# EasyEDA Pro project Dual_handheld_laser_sword_2.0.eprj

# Schematic Laserreczny2.0
Board Name: Laserreczny2.0; Create Date: 2024-09-04; Page Name: Laserreczny2.0; Project Name: Laserreczny2.0-2023-01-02_124553; Schematic Name: Laserreczny2.0; Update Date: 2025-07-18; Company: EasyEDA.com; Page Size: A4; Version: V1.0
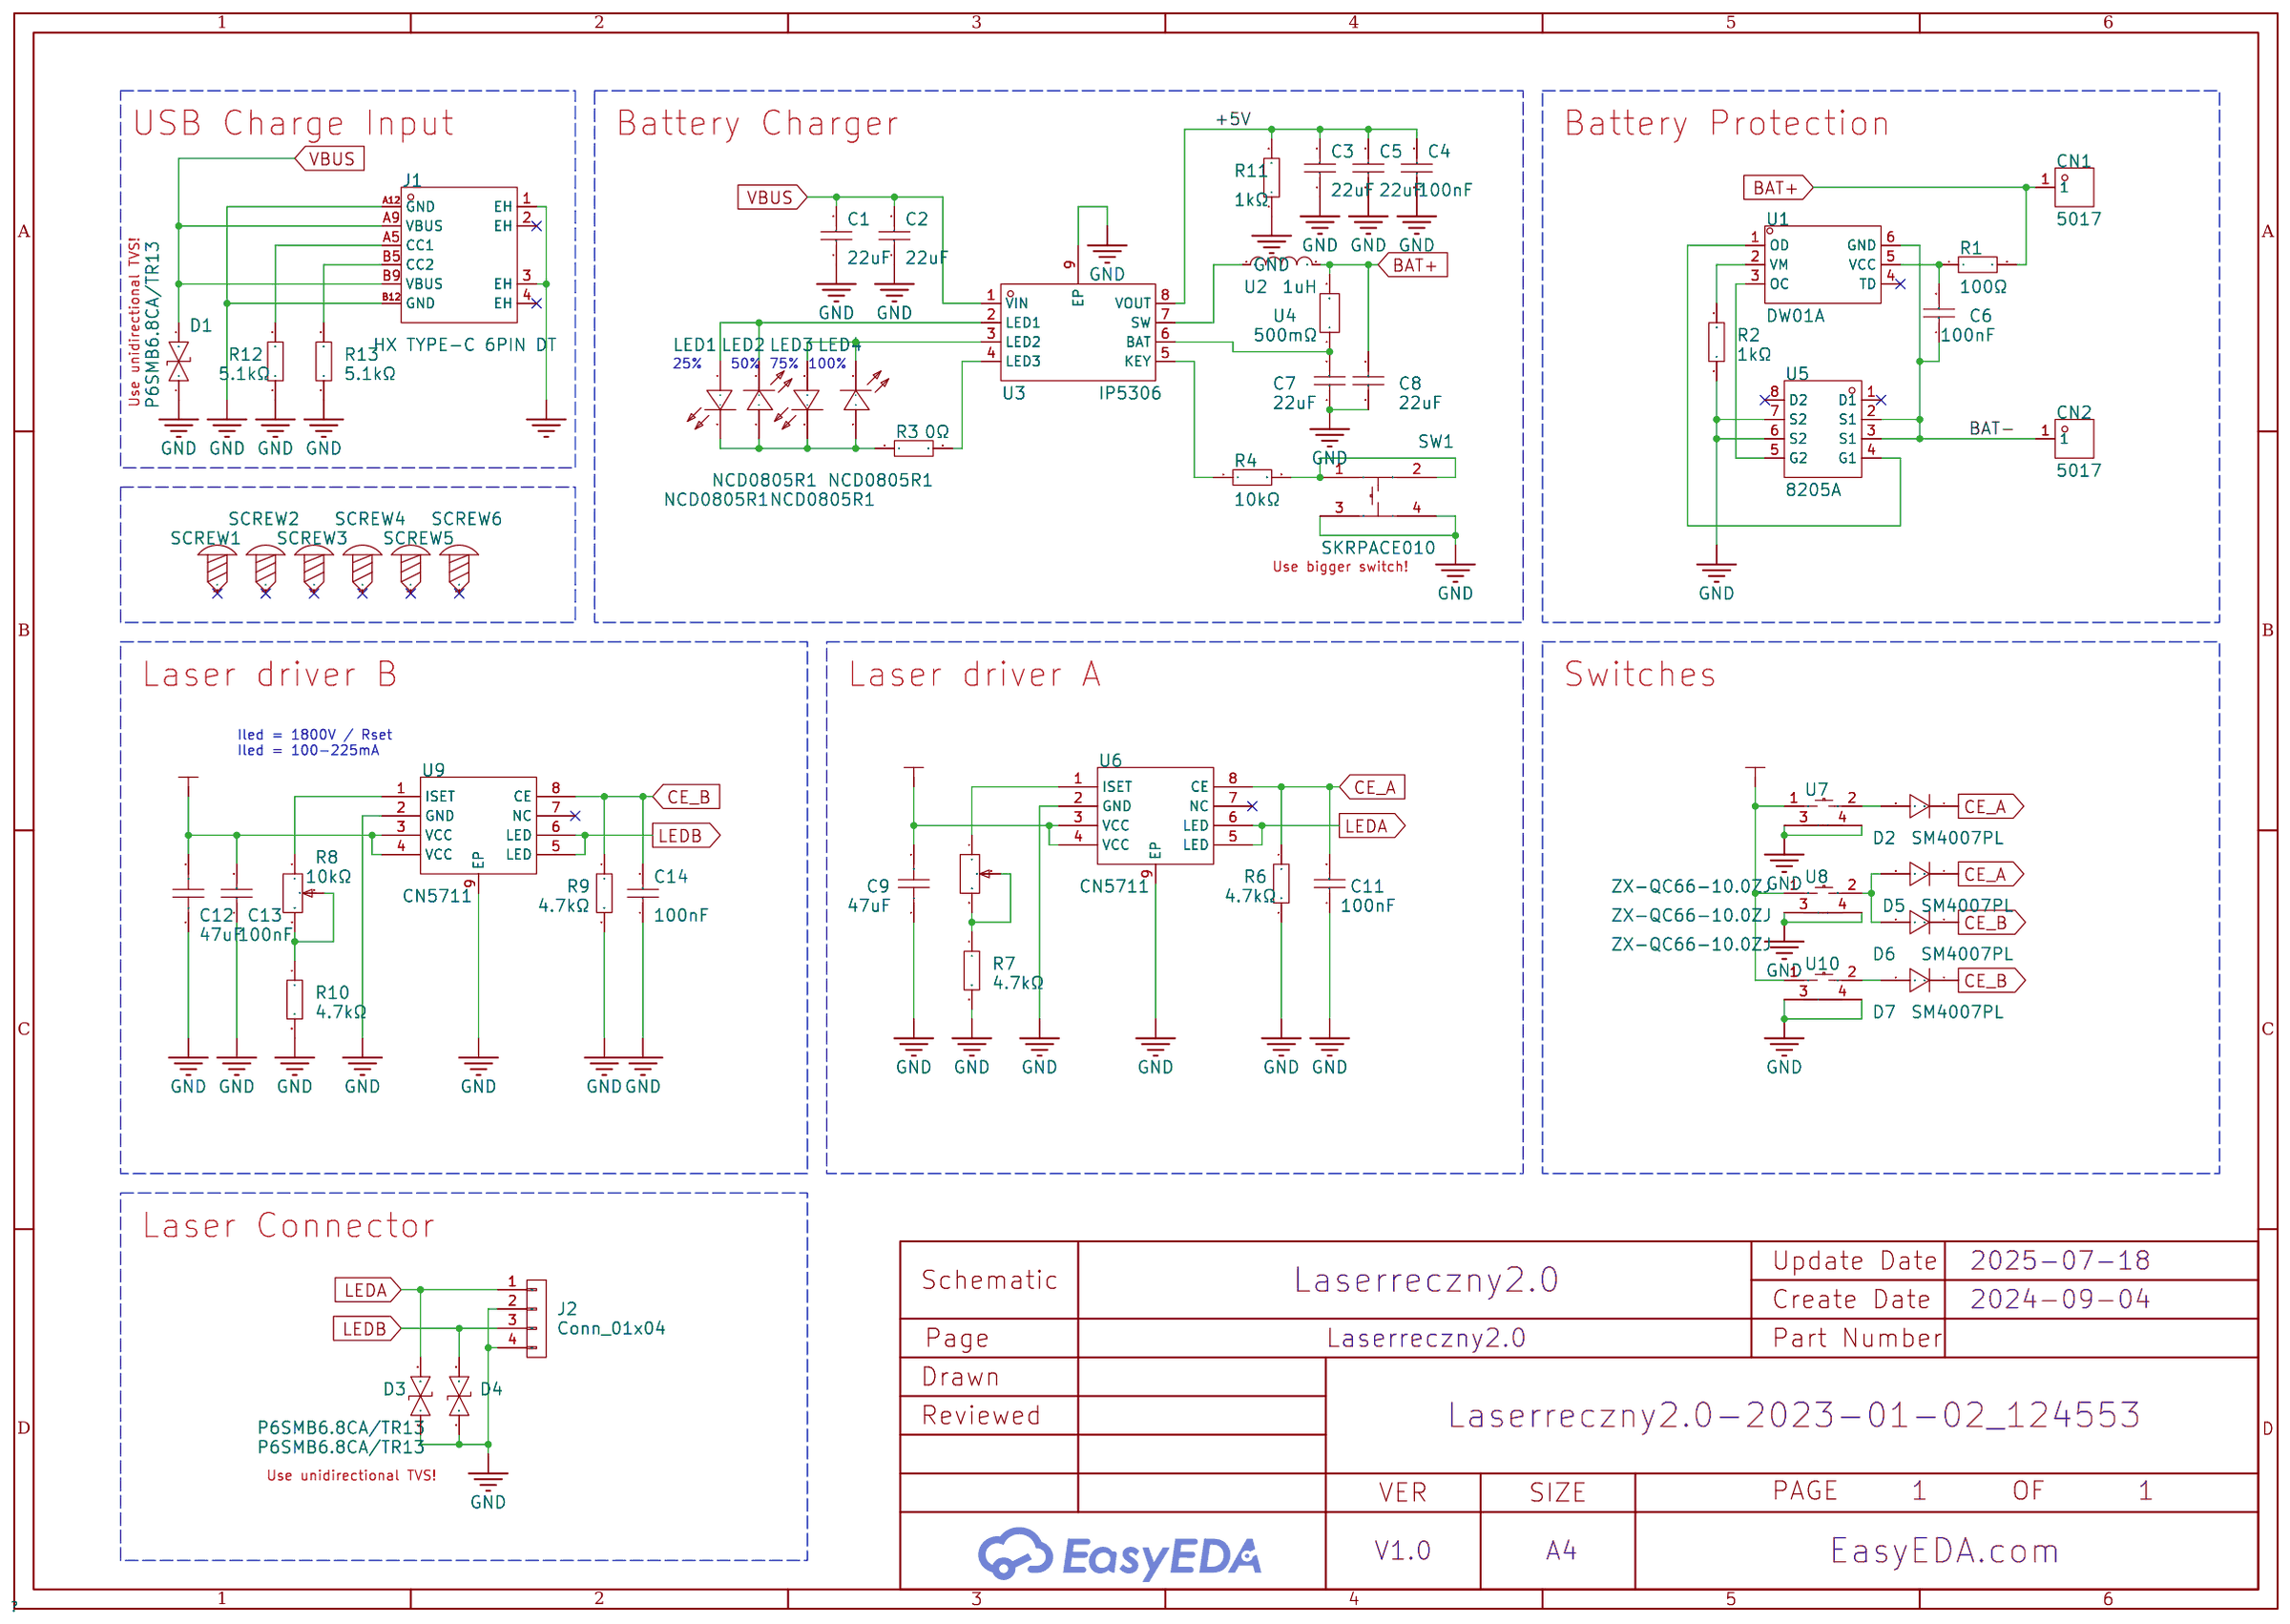
[diagram p0: schematic sheet]

## Parts
C1  22uF  [C1206]
C2  22uF  [C1206]
C3  22uF  [C1206]
C4  22uF  [C1206]
C5  100nF  [C1206]
C6  100nF  [C1206]
C7  22uF  [C1206]
C8  22uF  [C1206]
C9  47uF  [C1206]
C11  100nF  [C1206]
C12  47uF  [C1206]
C13  100nF  [C1206]
C14  100nF  [C1206]
CN1  5017  [CONN-SMD_5017]  (no BOM)
CN2  5017  [CONN-SMD_5017]  (no BOM)
D1  P6SMB6.8CA/TR13  [SMB_L4.6-W3.6-LS5.3-BI]
D2  SM4007PL  [SOD-123F_L2.8-W1.8-LS3.7-RD]
D3  P6SMB6.8CA/TR13  [SMB_L4.6-W3.6-LS5.3-BI]
D4  P6SMB6.8CA/TR13  [SMB_L4.6-W3.6-LS5.3-BI]
D5  SM4007PL  [SOD-123F_L2.8-W1.8-LS3.7-RD]
D6  SM4007PL  [SOD-123F_L2.8-W1.8-LS3.7-RD]
D7  SM4007PL  [SOD-123F_L2.8-W1.8-LS3.7-RD]
J1  HX TYPE-C 6PIN DT  [TYPE-C-SMD_TYPE-C-31-M-16]
J2  Conn_01x04  [Nowy folder:UCHWYTLASERA3]  (no BOM)
LED1  NCD0805R1  [LED0805-R-RD]
LED2  NCD0805R1  [LED0805-R-RD]
LED3  NCD0805R1  [LED0805-R-RD]
LED4  NCD0805R1  [LED0805-R-RD]
R1  100Ω  [R0805]
R2  1kΩ  [R0805]
R3  0Ω  [R1206]
R4  10kΩ  [R1206]
R5  10kΩ  [RES-ADJ-TH_3296W]
R6  4.7kΩ  [R1206]
R7  4.7kΩ  [R1206]
R8  10kΩ  [RES-ADJ-TH_3296W]
R9  4.7kΩ  [R1206]
R10  4.7kΩ  [R1206]
R11  1kΩ  [R0805]
R12  5.1kΩ  [R0805]
R13  5.1kΩ  [R0805]
SCREW1  -  [Screw-Hole-M2]
SCREW2  -  [Screw-Hole-M2]
SCREW3  -  [Screw-Hole-M2]
SCREW4  -  [Screw-Hole-M2]
SCREW5  -  [Screw-Hole-M3]
SCREW6  -  [Screw-Hole-M3]
SW1  SKRPACE010  [KEY-SMD_4P-L4.2-W3.2-P2.20-LS4.6]
U1  DW01A  [SOT-23-6_L2.9-W1.6-P0.95-LS2.8-BL]
U2  1uH  [IND-SMD_L11.5-W10.0]
U3  IP5306  [ESOP-8_L4.9-W3.9-P1.27-LS6.0-BL-EP]
U4  500mΩ  [R0603]
U5  8205A  [TSSOP-8_L4.4-W3.0-P0.65-LS6.4-BL]
U6  CN5711  [SOIC-8_L5.0-W4.0-P1.27-LS6.0-BL-EP2.0]
U7  ZX-QC66-10.0ZJ  [SW-TH_4P-L7.5-W5.5-P4.50]
U8  ZX-QC66-10.0ZJ  [SW-TH_4P-L7.5-W5.5-P4.50]
U9  CN5711  [SOIC-8_L5.0-W4.0-P1.27-LS6.0-BL-EP2.0]
U10  ZX-QC66-10.0ZJ  [SW-TH_4P-L7.5-W5.5-P4.50]

## Library data of the parts
C1-C4 C7 C8 = CL31A226KAHNNNE: LCSC Part Name: 22uF ±10% 25V; Supplier Part: C12891; Manufacturer: SAMSUNG(三星); Supplier Footprint: 1206; JLCPCB Part Class: Basic Part; Datasheet: https://atta.szlcsc.com/upload/public/pdf/source/20160218/1457707763339.pdf; Supplier: LCSC; Tolerance: ±10%
C5 C6 C11 C13 C14 = CL31B104KBCNNNC: LCSC Part Name: 100nF ±10% 50V; Supplier Part: C24497; Manufacturer: SAMSUNG(三星); Supplier Footprint: 1206; JLCPCB Part Class: Basic Part; Datasheet: https://atta.szlcsc.com/upload/public/pdf/source/20160218/1457707763339.pdf; Supplier: LCSC; Tolerance: ±10%
C9 C12 = CL31A476MPHNNNE: LCSC Part Name: 47uF ±20% 10V; Supplier Part: C96123; Manufacturer: SAMSUNG(三星); Supplier Footprint: 1206; JLCPCB Part Class: Basic Part; Datasheet: https://atta.szlcsc.com/upload/public/pdf/source/20160218/1457707763339.pdf; Supplier: LCSC; Tolerance: ±20%
CN1 CN2 = 5017: Supplier Part: C9900015874; Supplier Footprint: Testpoint_SMD; JLCPCB Part Class: Extended Part; Supplier: LCSC
D1 D3 D4 = P6SMB6.8CA/TR13: Supplier Part: C78395; Manufacturer: Brightking(君耀电子); Supplier Footprint: SMB(DO-214AA); JLCPCB Part Class: Basic Part; Datasheet: https://atta.szlcsc.com/upload/public/pdf/source/20160709/1468031879762.pdf; Supplier: LCSC; Reverse Stand-Off Voltage (Vrwm): 5.8V; Maximum Clamping Voltage: 10.5V; Peak Pulse Current (Ipp)@10/1000us: 58.1A; Peak Pulse Power Dissipation (Ppp)@10/1000us: 600W; Breakdown Voltage: 6.45V; Type: TVS
D2 D5-D7 = SM4007PL_C64898: LCSC Part Name: 电压:1kV 电流:1A; Supplier Part: C64898; Manufacturer: MDD(辰达半导体); Supplier Footprint: SOD-123FL; JLCPCB Part Class: Basic Part; Datasheet: https://atta.szlcsc.com/upload/public/pdf/source/20230823/16A8FDE162764C9B685A3717F2DA3690.pdf; Supplier: LCSC; Forward Voltage (Vf@If): 1.1V@1A; Reverse Leakage Current: 10uA@1kV
J1 = HX TYPE-C 6PIN DT: Connector Type:Type-C Gender:Female Mounting Style:Horizontal attachment Number of Contacts:6P Number of Ports:1 Current Rating - Power (Max):3A Operating Temperature Range:-25℃~+85℃ Operating Temperature Range:-25℃~+85℃; LCSC Part Name: Type-C 母 卧贴; Supplier Part: C18357554; Manufacturer: hanxia(韩下); Supplier Footprint: SMD; JLCPCB Part Class: Extended Part; Datasheet: https://atta.szlcsc.com/upload/public/pdf/source/20240715/9DA76AB0C307AE71049E18D789077764.pdf; Supplier: LCSC; Connector Type: Type-C; Gender: Female; Mounting Style: Horizontal attachment; Number of Contacts: 6P; Number of Ports: 1; Current Rating - Power (Max): 3A; Operating Temperature Range: -25℃~+85℃
J2 = New_Library2_Conn_01x04
LED1-LED4 = NCD0805R1_C84256: Supplier Part: C84256; Manufacturer: 国星光电; Supplier Footprint: 0805; JLCPCB Part Class: Basic Part; Datasheet: https://atta.szlcsc.com/upload/public/pdf/source/20200820/C84256_F0A75A43B3EAD75808600A0514C76B99.pdf; Supplier: LCSC; Emitted Color: Red; Forward Voltage (VF): 1.6V~2.6V; Power Dissipation: 65mW; Forward Current: 20mA; Dominant Wavelength: 615nm~630nm; Diode Configuration: 独立二极管; Lens Color: 无色透明透镜; Luminous Intensity: 67mcd~195mcd; Viewing Angle: 130°; Operating Temperature: -30℃~+85℃
R1 = 0805W8F1000T5E_C17408: LCSC Part Name: 100Ω ±1% 125mW 厚膜电阻; Supplier Part: C17408; Manufacturer: UNI-ROYAL(厚声); Manufacturer Part: 0805W8F1000T5E; Supplier Footprint: 0805; JLCPCB Part Class: Basic Part; Datasheet: https://atta.szlcsc.com/upload/public/pdf/source/20200306/C422600_1E6D84923E4A46A82E41ADD87F860B5C.pdf; Supplier: LCSC; Type: Thick Film Resistors; Tolerance: ±1%; Temperature Coefficient: ±100ppm/℃; Operating Temperature Range: -55℃~+155℃
R2 R11 = 0805W8F1001T5E: LCSC Part Name: 1kΩ ±1% 125mW 厚膜电阻; Supplier Part: C17513; Manufacturer: UNI-ROYAL(厚声); Supplier Footprint: 0805; JLCPCB Part Class: Basic Part; Datasheet: https://atta.szlcsc.com/upload/public/pdf/source/20200306/C422600_1E6D84923E4A46A82E41ADD87F860B5C.pdf; Supplier: LCSC; Type: Thick Film Resistors; Tolerance: ±1%; Temperature Coefficient: ±100ppm/℃; Operating Temperature Range: -55℃~+155℃
R3 = 1206W4F0000T5E: LCSC Part Name: 0Ω ±1% 250mW 厚膜电阻; Supplier Part: C17888; Manufacturer: UNI-ROYAL(厚声); Supplier Footprint: 1206; JLCPCB Part Class: Basic Part; Datasheet: https://atta.szlcsc.com/upload/public/pdf/source/20200306/C422600_1E6D84923E4A46A82E41ADD87F860B5C.pdf; Supplier: LCSC; Type: Thick Film Resistors; Tolerance: ±1%; Temperature Coefficient: ±800ppm/℃; Operating Temperature Range: -55℃~+155℃
R4 = 1206W4F1002T5E: LCSC Part Name: 10kΩ ±1% 250mW 厚膜电阻; Supplier Part: C17902; Manufacturer: UNI-ROYAL(厚声); Supplier Footprint: 1206; JLCPCB Part Class: Basic Part; Datasheet: https://atta.szlcsc.com/upload/public/pdf/source/20200306/C422600_1E6D84923E4A46A82E41ADD87F860B5C.pdf; Supplier: LCSC; Type: Thick Film Resistors; Tolerance: ±1%; Temperature Coefficient: ±100ppm/℃; Operating Temperature Range: -55℃~+155℃
R5 R8 = 3296W-1-103LF: LCSC Part Name: 10kΩ ±10%; Supplier Part: C34846; Manufacturer: BOURNS; Supplier Footprint: SIP-3P,9.5x4.8mm; JLCPCB Part Class: Extended Part; Datasheet: https://atta.szlcsc.com/upload/public/pdf/source/20151026/1457707506403.pdf; Supplier: LCSC; Tolerance: ±10%; Temperature Coefficient: ±100ppm/℃
R6 R7 R9 R10 = 1206W4F4701T5E: LCSC Part Name: 4.7kΩ ±1% 250mW 厚膜电阻; Supplier Part: C17936; Manufacturer: UNI-ROYAL(厚声); Supplier Footprint: 1206; JLCPCB Part Class: Basic Part; Datasheet: https://atta.szlcsc.com/upload/public/pdf/source/20200306/C422600_1E6D84923E4A46A82E41ADD87F860B5C.pdf; Supplier: LCSC; Type: Thick Film Resistors; Tolerance: ±1%; Temperature Coefficient: ±100ppm/℃; Operating Temperature Range: -55℃~+155℃
R12 R13 = RMC08055.1K5%N: LCSC Part Name: 5.1kΩ ±5% 125mW; Supplier Part: C269736; Manufacturer: Tyohm(幸亚电阻); Supplier Footprint: 0805; JLCPCB Part Class: Extended Part; Datasheet: https://atta.szlcsc.com/upload/public/pdf/source/20190115/C325956_D27151D492FFB3C9AB4A6F14FE01F30A.pdf; Supplier: LCSC; Tolerance: ±5%
SCREW1-SCREW4 = Screw-Hole-M2: Supplier Footprint: 插件
SCREW5 SCREW6 = Screw-Hole-M3: Supplier Footprint: 插件
SW1 = SKRPACE010: LCSC Part Name: 4.2*3.2*2.5mm 立贴 轻触开关; Supplier Part: C139797; Manufacturer: ALPSALPINE(阿尔卑斯阿尔派); Supplier Footprint: SMD; JLCPCB Part Class: Extended Part; Datasheet: https://atta.szlcsc.com/upload/public/pdf/source/20171113/C139797_15105612676371115729.pdf; Supplier: LCSC; Circuit: SPST; Actuator Style: Oval button; Mounting Style: Brick nogging; Switch Length: 4.2mm; Switch Width: 3.2mm; Switch Height: 2.5mm; Contact Current: 50mA; Voltage Rating (DC): 16V
U1 = DW01A_C351410: Supplier Part: C351410; Manufacturer: PUOLOP(迪浦); Supplier Footprint: SOT-23-6L; JLCPCB Part Class: Extended Part; Datasheet: https://atta.szlcsc.com/upload/public/pdf/source/20190109/C351410_3E9B9491D1909DF24C48D1B9CD871392.pdf; Supplier: LCSC
U2 = FXL1050-1R0-M: LCSC Part Name: 1uH ±20% 30A; Supplier Part: C5359257; Manufacturer: cjiang(长江微电); Supplier Footprint: SMD,10x11.5mm; JLCPCB Part Class: Extended Part; Datasheet: https://atta.szlcsc.com/upload/public/pdf/source/20240426/3189EA8206330E2108542F9E34E540E7.pdf; Supplier: LCSC; Tolerance: ±20%; Saturation Current (Isat): 30A; Type: Integrated molded inductor
U3 = IP5306: Supplier Part: C181692; Manufacturer: INJOINIC(英集芯); Supplier Footprint: ESOP-8; JLCPCB Part Class: Extended Part; Datasheet: https://atta.szlcsc.com/upload/public/pdf/source/20190627/C384572_9925B3DDC4041BC6108E5AB46A2A0AB1.pdf; Supplier: LCSC
U4 = FRL0603JR500TS: LCSC Part Name: 500mΩ ±5% 100mW 厚膜电阻; Supplier Part: C2930046; Manufacturer: FOJAN(富捷); Supplier Footprint: 0603; JLCPCB Part Class: Extended Part; Datasheet: https://atta.szlcsc.com/upload/public/pdf/source/20211221/925EC7D7225764EE0046F22065062C87.pdf; Supplier: LCSC; Type: Thick Film Resistors; Tolerance: ±5%; Temperature Coefficient: ±300ppm/℃; Operating Temperature Range: -55℃~+155℃
U5 = 8205A_C7499846: LCSC Part Name: 2个N沟道 耐压:20V 电流:6A; Supplier Part: C7499846; Manufacturer: HL(富海微); Supplier Footprint: TSSOP-8; JLCPCB Part Class: Extended Part; Datasheet: https://atta.szlcsc.com/upload/public/pdf/source/20240724/664F23CBF70CFE9FA07822926B1155CC.pdf; Supplier: LCSC; Type: 2 N-Channel; Drain Source Voltage (Vdss): 20V; Drain Source On Resistance (RDS(on)@Vgs,Id): 19mΩ; Gate Threshold Voltage (Vgs(th)@Id): 1.2V
U6 U9 = CN5711: Supplier Part: C35634; Manufacturer: CONSONANCE(上海如韵); Supplier Footprint: SOIC-8-EP; JLCPCB Part Class: Extended Part; Datasheet: https://atta.szlcsc.com/upload/public/pdf/source/20151111/1457707576158.pdf; Supplier: LCSC; Input Voltage: 2.8V~6V
U7 U8 U10 = ZX-QC66-10.0ZJ: LCSC Part Name: 6*6*10.0支架; Supplier Part: C7470149; Manufacturer: Megastar(兆星); Supplier Footprint: DIP; JLCPCB Part Class: Extended Part; Datasheet: https://atta.szlcsc.com/upload/public/pdf/source/20230724/750A58BC0FA2FA475D6161C007562EDE.pdf; Supplier: LCSC; Circuit: SPST; Actuator Style: Round Button; Operating Force: 260gf; Mounting Style: Straight; Switch Length: 6mm; Switch Width: 6mm; Switch Height: 10mm; Strike Gundam: 带支架; Contact Current: 50mA; Voltage Rating (AC): 250V; Voltage Rating (DC): 12V; Insulation Resistance: 100MΩ; Actuator/Cap Color: Black; Pin Style: PCPin; Mechanical Life: 10万次; Operating Temperature: -30℃~+80℃

## Nets
+5V: C3.2 C4.2 C5.2 R11.2 U3.8(VOUT)
GND: C1.1 C2.1 C3.1 C4.1 C5.1 C7.1 C8.1 C9.1 C11.1 C12.1 C13.1 C14.1 D1.1 D3.1 D4.1 J1.A12(GND) J1.B12(GND) J2.2(Pin) J2.4(Pin) R2.1 R6.2 R7.2 R9.2 R10.2 R11.1 R12.1 R13.1 SW1.3 SW1.4 U3.9(EP) U5.6(S2) U5.7(S2) U6.2(GND) U6.9(EP) U7.3 U7.4 U8.3 U8.4 U9.2(GND) U9.9(EP) U10.3 U10.4
VBUS: C1.2 C2.2 D1.2 J1.A9(VBUS) J1.B9(VBUS) U3.1(VIN)
BAT+: C8.2 C9.2 C12.2 C13.2 CN1.1 R1.2 U2.2 U4.2 U6.3(VCC) U6.4(VCC) U7.1 U8.1 U9.3(VCC) U9.4(VCC) U10.1
BAT-: C6.1 CN2.1 J1.1(EH) J1.3(EH) U1.6(GND) U5.2(S1) U5.3(S1)
CE_A: C11.2 D2.1(C) D5.1(C) R6.1 U6.8(CE)
CE_B: C14.2 D6.1(C) D7.1(C) R9.1 U9.8(CE)
LEDA: D3.2 J2.1(Pin) U6.5(LED) U6.6(LED)
LEDB: D4.2 J2.3(Pin) U9.5(LED) U9.6(LED)
$1N3617: R5.2 R5.3 R7.1
$1N3639: R8.2 R8.3 R10.1
$1N4317: D2.2(A) U7.2
$1N4424: D7.2(A) U10.2
$1N4465: D5.2(A) D6.2(A) U8.2
$1N5157: R3.2 U3.4(LED3)
$1N5164: LED1.2(-) LED2.1(+) LED3.2(-) LED4.1(+) R3.1
$1N5205: LED3.1(+) LED4.2(-) U3.3(LED2)
$1N5221: LED1.1(+) LED2.2(-) U3.2(LED1)
$1N5255: R4.1 U3.5(KEY)
$1N6778: U2.1 U3.7(SW)
$1N6905: R4.2 SW1.1 SW1.2
$1N7101: C7.2 U3.6(BAT) U4.1
$1N13509: R2.2 U1.2(VM)
$1N13530: U1.3(OC) U5.5(G2)
$1N13537: U1.1(OD) U5.4(G1)
$1N13688: C6.2 R1.1 U1.5(VCC)
$1N13830: R8.1 U9.1(ISET)
$1N13861: R5.1 U6.1(ISET)
$1N21573: J1.A5(CC1) R12.2
$1N21578: J1.B5(CC2) R13.2

Not connected (* = marked no-connect by the designer): J1 2(EH)* 4(EH)*; SCREW1 1*; SCREW2 1*; SCREW3 1*; SCREW4 1*; SCREW5 1*; SCREW6 1*; U1 4(TD)*; U5 1(D1)* 8(D2)*; U6 7(NC)*; U9 7(NC)*

## Notes on the sheet
- USB Charge Input
- Battery Charger
- Battery Protection
- 25%
- 50%
- 75%
- 100%
- Use unidirectional TVS!
- Use bigger switch!
- Laser driver B
- Laser driver A
- Switches
- Iled = 1800V / Rset
  Iled = 100-225mA
- Laser Connector
- Use unidirectional TVS!

# Board Laserreczny2.0
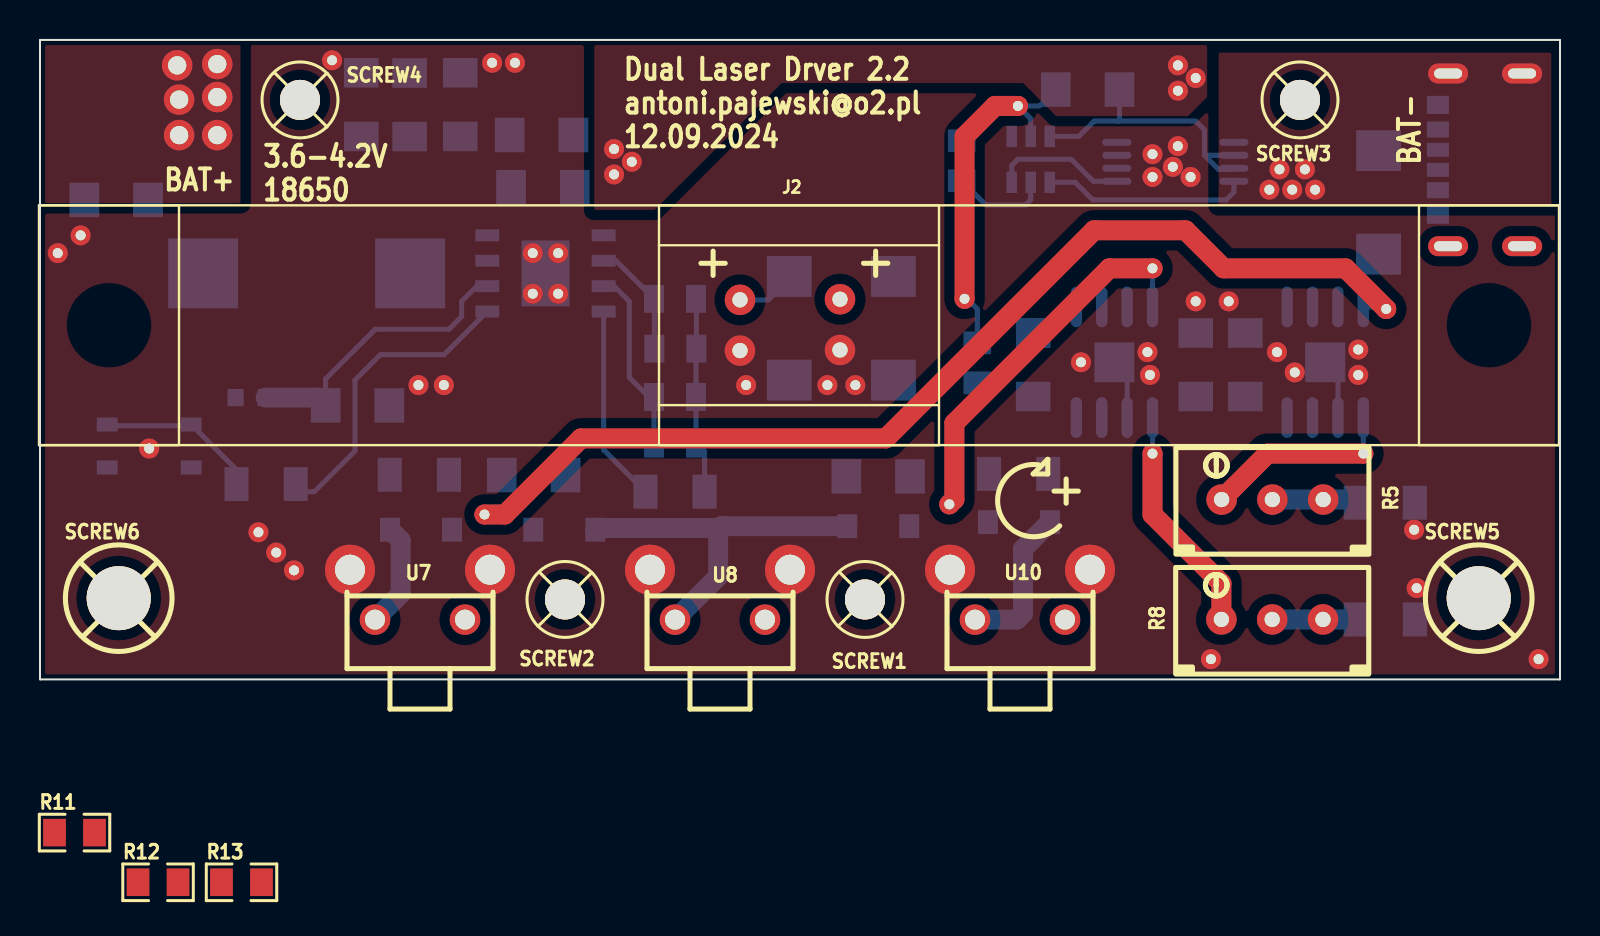
[diagram p1: board, top side]
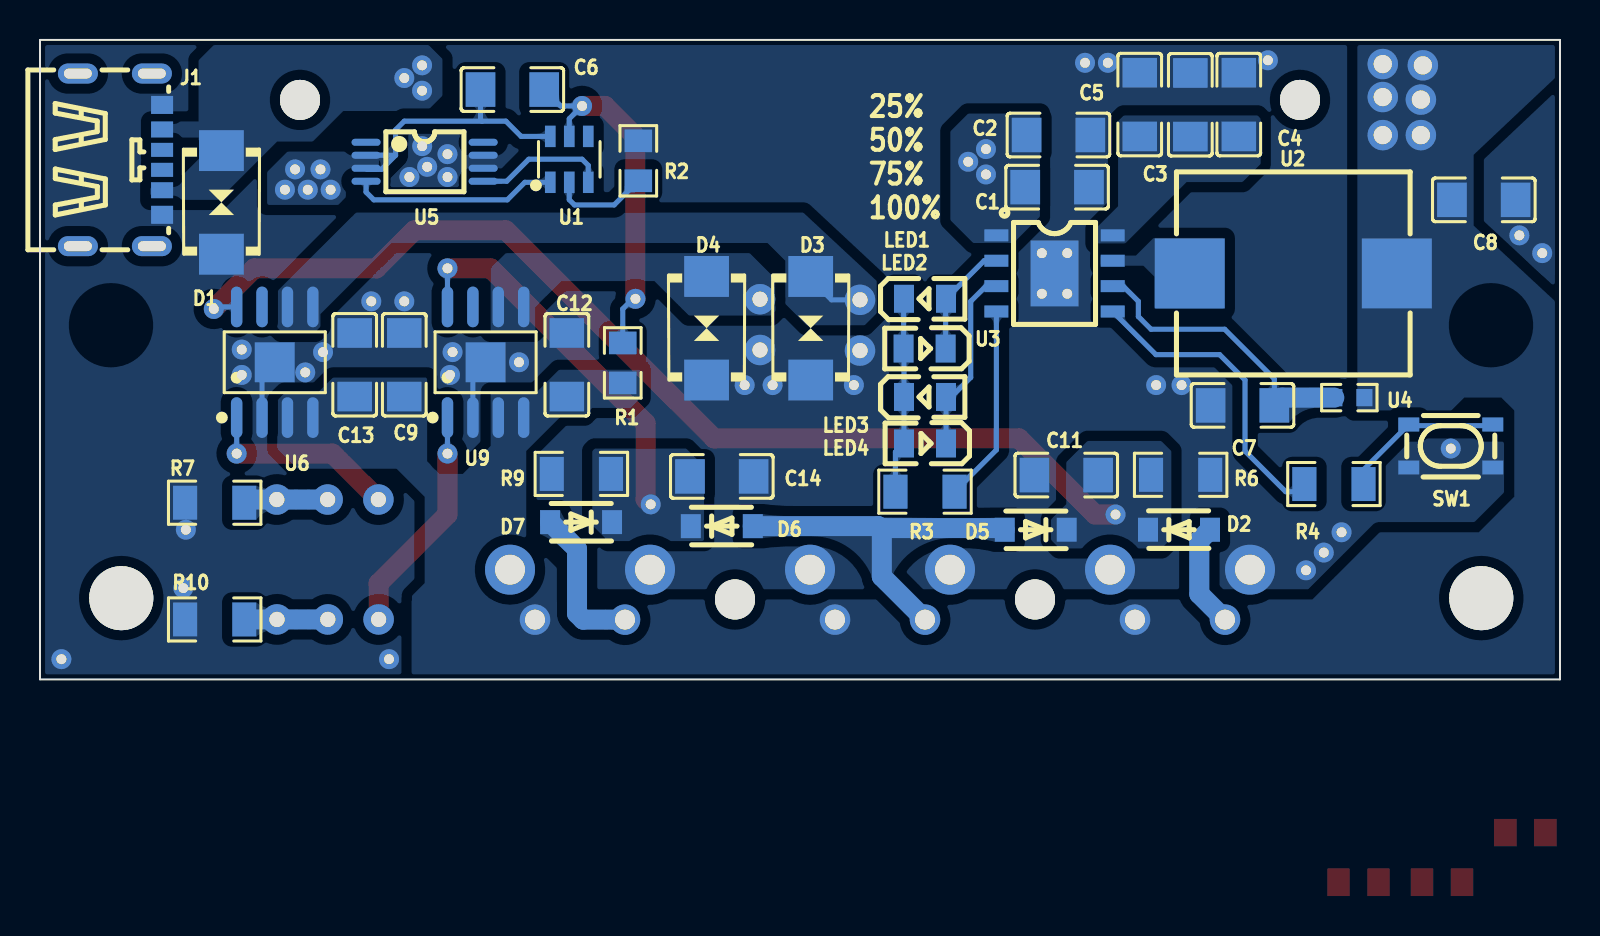
[diagram p2: board, bottom side, seen from below]

Outline 76 x 32 mm; copper layers: Top Layer, Bottom Layer. Coordinates in mm from the lower left corner of the outline.
Outline path: 0,32 76,32 76,0 0,0 0,32
Stack: Top Layer 0.035mm / dielectric 1 1.6mm FR4 er 4.5 / Bottom Layer 0.035mm

## Design rules (mm)
template: User Custom Config
spacing safeClearance (default): track to track 0.152, other pairs 0.152 to 0.3
track width trackWidth (default): min 0.127, default 0.254, max 2.54
differential pair differentialPair (default): width min 0.127, default 0.254, max 2.54; gap min 0.152, default 0.152
via viaSize (default): diameter min 0.5, default 0.61, max 10; hole min 0.3, default 0.305, max 5.999
net GND uses CopperRegion1
net LEDA uses CopperRegion1
net LEDB uses CopperRegion1
net BAT+ uses CopperRegion1
net VBUS uses CopperRegion1
net CE_A uses CopperRegion1
net CE_B uses CopperRegion1
net $1N6778 uses CopperRegion1
net $1N11856 uses CopperRegion1
net BAT- uses CopperRegion1

## Placement (name value [footprint] x y rotation side)
C1  22uF  [C1206]  25.15 24.63 0 bottom
C2  22uF  [C1206]  25.08 27.24 0 bottom
C3  22uF  [C1206]  18.48 28.76 270 bottom
C4  22uF  [C1206]  16.06 28.77 270 bottom
C5  100nF  [C1206]  21.01 28.77 270 bottom
C6  100nF  [C1206]  52.38 29.52 180 bottom
C7  22uF  [C1206]  15.88 13.71 180 bottom
C8  22uF  [C1206]  3.81 24 0 bottom
C9  47uF  [C1206]  57.78 15.74 270 bottom
C11  100nF  [C1206]  24.69 10.22 180 bottom
C12  47uF  [C1206]  49.66 15.74 270 bottom
C13  100nF  [C1206]  60.27 15.74 270 bottom
C14  100nF  [C1206]  41.91 10.16 0 bottom
D1  P6SMB6.8CA/TR13  [SMB_L4.6-W3.6-LS5.3-BI]  66.93 23.87 90 bottom
D2  SM4007PL  [SOD-123F_L2.8-W1.8-LS3.7-RD]  19.05 7.49 180 bottom
D3  P6SMB6.8CA/TR13  [SMB_L4.6-W3.6-LS5.3-BI]  37.47 17.57 90 bottom
D4  P6SMB6.8CA/TR13  [SMB_L4.6-W3.6-LS5.3-BI]  42.67 17.57 90 bottom
D5  SM4007PL  [SOD-123F_L2.8-W1.8-LS3.7-RD]  26.21 7.49 0 bottom
D6  SM4007PL  [SOD-123F_L2.8-W1.8-LS3.7-RD]  41.91 7.67 180 bottom
D7  SM4007PL  [SOD-123F_L2.8-W1.8-LS3.7-RD]  48.95 7.87 0 bottom
J1  HX TYPE-C 6PIN DT  [TYPE-C-SMD_TYPE-C-31-M-16]  72 26 270 bottom
J2  Conn_01x04  [Nowy folder:UCHWYTLASERA3]  37.5 17.67 0 top
LED1  NCD0805R1  [LED0805-R-RD]  31.75 19.05 180 bottom
LED2  NCD0805R1  [LED0805-R-RD]  31.77 16.56 0 bottom
LED3  NCD0805R1  [LED0805-R-RD]  31.75 14.13 180 bottom
LED4  NCD0805R1  [LED0805-R-RD]  31.75 11.81 0 bottom
NOREF  -  [Pad_e74]  68.71 7.49 0 top
NOREF#2  -  [Pad_e365]  22.22 8.25 0 top
NOREF#3  -  [Pad_e552]  28.7 26.54 90 top
NOREF#4  -  [Pad_e73]  68.83 4.57 0 top
NOREF#5  -  [Pad_e76]  59.44 18.92 0 top
NOREF#6  -  [Pad_e717]  8.86 27.24 0 top
NOREF#7  -  [Pad_e69]  10.92 7.36 0 top
NOREF#8  -  [Pad_e90]  22.61 30.86 0 top
NOREF#9  -  [Pad_e533]  56.9 29.46 90 top
NOREF#10  -  [Pad_e245]  65.91 16.51 0 top
NOREF#11  -  [Pad_e337]  48.9 28.7 0 top
NOREF#12  -  [Pad_e159]  55.63 20.57 0 top
NOREF#13  -  [Pad_e177]  25.91 21.33 0 top
NOREF#14  -  [Pad_e181]  24.64 19.3 0 top
NOREF#15  -  [Pad_e86]  35.31 14.73 0 top
NOREF#16  -  [Pad_e94]  58.55 1.01 0 top
NOREF#17  -  [Pad_e77]  40.77 14.73 0 top
NOREF#18  -  [Pad_e290]  56.89 26.69 0 top
NOREF#19  -  [Pad_e70]  5.46 11.55 0 top
NOREF#20  -  [Pad_e553]  28.7 25.27 90 top
NOREF#21  -  [Pad_e91]  23.75 30.86 0 top
NOREF#22  -  [Pad_e536]  55.63 26.28 0 top
NOREF#23  -  [Pad_e558]  62.61 24.51 90 top
NOREF#24  -  [Pad_e244]  65.91 15.24 0 top
NOREF#25  -  [Pad_e235]  55.37 16.38 0 top
NOREF#26  -  [Pad_e714]  6.96 29.02 0 top
NOREF#27  -  [Pad_e180]  24.64 21.33 0 top
NOREF#28  -  [Pad_e537]  56.64 25.65 0 top
NOREF#29  -  [Pad_e236]  52.05 15.87 0 top
NOREF#30  -  [Pad_e715]  6.96 27.24 0 top
NOREF#31  -  [Pad_e88]  20.19 14.73 0 top
NOREF#32  -  [Pad_e15]  66.17 11.3 0 top
NOREF#33  -  [Pad_e67]  12.7 5.46 0 top
NOREF#34  -  [Pad_e143]  6.86 30.73 0 top
NOREF#35  -  [Pad_e535]  55.63 25.14 0 top
NOREF#36  -  [Pad_e89]  14.61 30.98 0 top
NOREF#37  -  [Pad_e727]  0.89 21.33 0 top
NOREF#38  -  [Pad_e238]  62.74 15.36 0 top
NOREF#39  -  [Pad_e530]  56.9 30.73 90 top
NOREF#40  -  [Pad_e366]  45.47 8.76 0 top
NOREF#41  -  [Pad_e719]  8.86 30.79 0 top
NOREF#42  -  [Pad_e557]  61.47 24.51 90 top
NOREF#43  -  [Pad_e562]  63.25 25.52 90 top
NOREF#44  -  [Pad_e16]  55.63 11.3 0 top
NOREF#45  -  [Pad_e534]  57.78 30.09 90 top
NOREF#46  -  [Pad_e559]  63.75 24.51 90 top
NOREF#47  -  [Pad_e560]  61.98 25.52 90 top
NOREF#48  -  [Pad_e160]  67.31 18.54 0 top
NOREF#49  -  [Pad_e289]  57.53 25.14 0 top
NOREF#50  -  [Pad_e726]  2.03 22.22 0 top
NOREF#51  -  [Pad_e243]  61.85 16.38 0 top
NOREF#52  -  [Pad_e68]  11.81 6.35 0 top
NOREF#53  -  [Pad_e303]  46.23 19.05 0 top
NOREF#54  -  [Pad_e179]  25.91 19.3 0 top
NOREF#55  -  [Pad_e93]  74.93 1.01 0 top
NOREF#56  -  [Pad_e554]  29.59 25.9 90 top
NOREF#57  -  [Pad_e75]  57.78 18.92 0 top
NOREF#58  -  [Pad_e85]  39.37 14.73 0 top
NOREF#59  -  [Pad_e718]  8.86 29.14 0 top
NOREF#60  -  [Pad_e87]  18.92 14.73 0 top
NOREF#61  -  [Pad_e237]  55.5 15.24 0 top
R1  100Ω  [R0805]  46.86 15.84 270 bottom
R2  1kΩ  [R0805]  46.08 25.95 270 bottom
R3  0Ω  [R1206]  31.75 9.39 180 bottom
R4  10kΩ  [R1206]  11.3 9.78 180 bottom
R5  10kΩ  [RES-ADJ-TH_3296W]  61.62 9 90 top
R6  4.7kΩ  [R1206]  18.97 10.24 180 bottom
R7  4.7kΩ  [R1206]  67.26 8.84 0 bottom
R8  10kΩ  [RES-ADJ-TH_3296W]  61.61 3 90 top
R9  4.7kΩ  [R1206]  48.93 10.28 0 bottom
R10  4.7kΩ  [R1206]  67.26 3 0 bottom
R11  1kΩ  [R0805]  1.73 -7.67 0 top
R12  5.1kΩ  [R0805]  5.9 -10.15 0 top
R13  5.1kΩ  [R0805]  10.08 -10.15 0 top
SCREW1  -  [Screw-Hole-M2]  41.25 4 0 top
SCREW2  -  [Screw-Hole-M2]  26.25 4 0 top
SCREW3  -  [Screw-Hole-M2]  63 29 0 top
SCREW4  -  [Screw-Hole-M2]  13 29 0 top
SCREW5  -  [Screw-Hole-M3]  72 4 0 top
SCREW6  -  [Screw-Hole-M3]  4 4 0 top
SW1  SKRPACE010  [KEY-SMD_4P-L4.2-W3.2-P2.20-LS4.6]  5.46 11.68 180 bottom
U1  DW01A  [SOT-23-6_L2.9-W1.6-P0.95-LS2.8-BL]  49.54 26.03 180 bottom
U2  1uH  [IND-SMD_L11.5-W10.0]  13.33 20.32 180 bottom
U3  IP5306  [ESOP-8_L4.9-W3.9-P1.27-LS6.0-BL-EP]  25.27 20.32 270 bottom
U4  500mΩ  [R0603]  10.53 14.1 180 bottom
U5  8205A  [TSSOP-8_L4.4-W3.0-P0.65-LS6.4-BL]  56.77 25.9 270 bottom
U6  CN5711  [SOIC-8_L5.0-W4.0-P1.27-LS6.0-BL-EP2.0]  64.26 15.87 180 bottom
U7  ZX-QC66-10.0ZJ  [SW-TH_4P-L7.5-W5.5-P4.50]  19 4.24 180 top
U8  ZX-QC66-10.0ZJ  [SW-TH_4P-L7.5-W5.5-P4.50]  34 4.24 180 top
U9  CN5711  [SOIC-8_L5.0-W4.0-P1.27-LS6.0-BL-EP2.0]  53.72 15.87 180 bottom
U10  ZX-QC66-10.0ZJ  [SW-TH_4P-L7.5-W5.5-P4.50]  49 4.24 180 top

## Footprints (pads in the part's own frame, mm; a bottom-side part is the same pattern mirrored in y, then rotated)
C1206
  rect 1.485x1.728 smd: 1(-1.593,0) 2(1.593,0)
ESOP-8_L4.9-W3.9-P1.27-LS6.0-BL-EP
  rect 0.6x1.2 smd: 1(-1.905,-2.909) 2(-0.635,-2.909) 3(0.635,-2.909) 4(1.905,-2.909) 5(1.905,2.909) 6(0.635,2.909) 7(-0.635,2.909) 8(-1.905,2.909)
  rect 3.3x2.4 smd: 9(0,0)
IND-SMD_L11.5-W10.0
  rect 3.5x3.5 smd: 1(-5.177,0) 2(5.177,0)
KEY-SMD_4P-L4.2-W3.2-P2.20-LS4.6
  rect 1.05x0.7 smd: 1(-2.1,1.075) 2(2.1,1.075) 3(-2.1,-1.075) 4(2.1,-1.075)
LED0805-R-RD
  rect 1x1.399 smd: 1(1.05,0) 2(-1.05,0)
Nowy folder:UCHWYTLASERA3
  round 0.001 hole 3.2: (-34.05,0.05) (34.95,0.05)
  round 1.524 hole 0.762: 1(-2.5,1.32) 2(-2.5,-1.22) 3(2.5,1.35) 4(2.5,-1.19)
Pad_e15
  round 1 hole 0.5: 1(0,0)
Pad_e16
  round 1 hole 0.5: 1(0,0)
Pad_e67
  round 1 hole 0.5: 1(0,0)
Pad_e68
  round 1 hole 0.5: 1(0,0)
Pad_e69
  round 1 hole 0.5: 1(0,0)
Pad_e70
  round 1 hole 0.5: 1(0,0)
Pad_e73
  round 1 hole 0.5: 1(0,0)
Pad_e74
  round 1 hole 0.5: 1(0,0)
Pad_e75
  round 1 hole 0.5: 1(0,0)
Pad_e76
  round 1 hole 0.5: 1(0,0)
Pad_e77
  round 1 hole 0.5: 1(0,0)
Pad_e85
  round 1 hole 0.5: 1(0,0)
Pad_e86
  round 1 hole 0.5: 1(0,0)
Pad_e87
  round 1 hole 0.5: 1(0,0)
Pad_e88
  round 1 hole 0.5: 1(0,0)
Pad_e89
  round 1 hole 0.5: 1(0,0)
Pad_e90
  round 1 hole 0.5: 1(0,0)
Pad_e91
  round 1 hole 0.5: 1(0,0)
Pad_e93
  round 1 hole 0.5: 1(0,0)
Pad_e94
  round 1 hole 0.5: 1(0,0)
Pad_e143
  round 1.524 hole 0.914: 1(0,0)
Pad_e159
  round 1 hole 0.5: 1(0,0)
Pad_e160
  round 1 hole 0.5: 1(0,0)
Pad_e177
  round 1 hole 0.5: 1(0,0)
Pad_e179
  round 1 hole 0.5: 1(0,0)
Pad_e180
  round 1 hole 0.5: 1(0,0)
Pad_e181
  round 1 hole 0.5: 1(0,0)
Pad_e235
  round 1 hole 0.5: 1(0,0)
Pad_e236
  round 1 hole 0.5: 1(0,0)
Pad_e237
  round 1 hole 0.5: 1(0,0)
Pad_e238
  round 1 hole 0.5: 1(0,0)
Pad_e243
  round 1 hole 0.5: 1(0,0)
Pad_e244
  round 1 hole 0.5: 1(0,0)
Pad_e245
  round 1 hole 0.5: 1(0,0)
Pad_e289
  round 1 hole 0.5: 1(0,0)
Pad_e290
  round 1 hole 0.5: 1(0,0)
Pad_e303
  round 1 hole 0.5: 1(0,0)
Pad_e337
  round 1 hole 0.5: 1(0,0)
Pad_e365
  round 1 hole 0.5: 1(0,0)
Pad_e366
  round 1 hole 0.5: 1(0,0)
Pad_e530
  round 1 hole 0.5: 1(0,0)
Pad_e533
  round 1 hole 0.5: 1(0,0)
Pad_e534
  round 1 hole 0.5: 1(0,0)
Pad_e535
  round 1 hole 0.5: 1(0,0)
Pad_e536
  round 1 hole 0.5: 1(0,0)
Pad_e537
  round 1 hole 0.5: 1(0,0)
Pad_e552
  round 1 hole 0.5: 1(0,0)
Pad_e553
  round 1 hole 0.5: 1(0,0)
Pad_e554
  round 1 hole 0.5: 1(0,0)
Pad_e557
  round 1 hole 0.5: 1(0,0)
Pad_e558
  round 1 hole 0.5: 1(0,0)
Pad_e559
  round 1 hole 0.5: 1(0,0)
Pad_e560
  round 1 hole 0.5: 1(0,0)
Pad_e562
  round 1 hole 0.5: 1(0,0)
Pad_e714
  round 1.524 hole 0.914: 1(0,0)
Pad_e715
  round 1.524 hole 0.914: 1(0,0)
Pad_e717
  round 1.524 hole 0.914: 1(0,0)
Pad_e718
  round 1.524 hole 0.914: 1(0,0)
Pad_e719
  round 1.524 hole 0.914: 1(0,0)
Pad_e726
  round 1 hole 0.5: 1(0,0)
Pad_e727
  round 1 hole 0.5: 1(0,0)
R0603
  rect 0.806x0.864 smd: 1(-0.753,0) 2(0.753,0)
R0805
  rect 1.133x1.377 smd: 1(-1,0) 2(1,0)
R1206
  rect 1.208x1.701 smd: 1(-1.479,0) 2(1.479,0)
RES-ADJ-TH_3296W
  round 1.524 hole 0.762: 1(0,2.54) 2(0,0) 3(0,-2.54)
Screw-Hole-M2
  round 2 hole 2: 1(0,0)
Screw-Hole-M3
  round 3.2 hole 3.2: 1(-0.064,0.064)
SMB_L4.6-W3.6-LS5.3-BI
  rect 2.047x2.241 smd: 1(-2.591,0) 2(2.591,0)
SOD-123F_L2.8-W1.8-LS3.7-RD
  rect 1x1.2 smd: 1(-1.55,0) 2(1.55,0)
SOIC-8_L5.0-W4.0-P1.27-LS6.0-BL-EP2.0
  oval 0.574x2.038 smd: 1(-1.905,-2.769) 2(-0.635,-2.769) 3(0.635,-2.769) 4(1.905,-2.769) 5(1.905,2.769) 6(0.635,2.769) 7(-0.635,2.769) 8(-1.905,2.769)
  rect 2x2 smd: 9(0,0)
SOT-23-6_L2.9-W1.6-P0.95-LS2.8-BL
  rect 0.532x1.072 smd: 1(-0.95,-1.149) 2(0,-1.149) 3(0.95,-1.149) 4(0.95,1.149) 5(0,1.149) 6(-0.95,1.149)
SW-TH_4P-L7.5-W5.5-P4.50
  round 1.524 hole 1: 1(-2.25,1.25) 2(2.25,1.25)
  round 2.5 hole 1.5: 3(-3.5,-1.25) 4(3.5,-1.25)
TSSOP-8_L4.4-W3.0-P0.65-LS6.4-BL
  oval 0.353x1.454 smd: 1(-0.975,-2.927) 2(-0.325,-2.927) 3(0.325,-2.927) 4(0.975,-2.927) 5(0.975,2.927) 6(0.325,2.927) 7(-0.325,2.927) 8(-0.975,2.927)
TYPE-C-SMD_TYPE-C-31-M-16
  oval 1x2 hole 0.5x1.4: 1(-4.32,1.595) 2(4.32,1.595) 3(-4.32,-2.105) 4(4.32,-2.105)
  rect 0.7x1.1 smd: A5(-0.5,2.105) B5(0.5,2.105)
  rect 0.8x1.1 smd: A9(1.52,2.105) B9(-1.52,2.105)
  rect 0.9x1.1 smd: A12(2.75,2.105) B12(-2.75,2.105)

## Nets
+5V: C3.2 C4.2 C5.2 R11.2 U3.8
GND: C1.1 C2.1 C3.1 C4.1 C5.1 C7.1 C8.1 C9.1 C11.1 C12.1 C13.1 C14.1 D1.1 D3.1 D4.1 J1.A12 J1.B12 J2.2 J2.4 NOREF.1 NOREF#4.1 NOREF#5.1 NOREF#7.1 NOREF#8.1 NOREF#10.1 NOREF#13.1 NOREF#14.1 NOREF#15.1 NOREF#16.1 NOREF#17.1 NOREF#18.1 NOREF#19.1 NOREF#21.1 NOREF#22.1 NOREF#24.1 NOREF#25.1 NOREF#27.1 NOREF#28.1 NOREF#29.1 NOREF#31.1 NOREF#33.1 NOREF#35.1 NOREF#36.1 NOREF#37.1 NOREF#38.1 NOREF#49.1 NOREF#50.1 NOREF#51.1 NOREF#52.1 NOREF#54.1 NOREF#55.1 NOREF#57.1 NOREF#58.1 NOREF#60.1 NOREF#61.1 R2.1 R6.2 R7.2 R9.2 R10.2 R11.1 R12.1 R13.1 SW1.3 SW1.4 U3.9 U5.6 U5.7 U6.2 U6.9 U7.3 U7.4 U8.3 U8.4 U9.2 U9.9 U10.3 U10.4
VBUS: C1.2 C2.2 D1.2 J1.A9 J1.B9 NOREF#3.1 NOREF#9.1 NOREF#20.1 NOREF#39.1 NOREF#45.1 NOREF#56.1 U3.1
BAT+: C8.2 C9.2 C12.2 C13.2 NOREF#6.1 NOREF#26.1 NOREF#30.1 NOREF#34.1 NOREF#41.1 NOREF#59.1 R1.2 U2.2 U4.2 U6.3 U6.4 U7.1 U8.1 U9.3 U9.4 U10.1
BAT-: C6.1 J1.1 J1.3 NOREF#23.1 NOREF#42.1 NOREF#43.1 NOREF#46.1 NOREF#47.1 U1.6 U5.2 U5.3
CE_A: C11.2 D2.1 D5.1 NOREF#2.1 NOREF#48.1 R6.1 U6.8
CE_B: C14.2 D6.1 D7.1 NOREF#12.1 NOREF#40.1 R9.1 U9.8
LEDA: D3.2 J2.1 U6.5 U6.6
LEDB: D4.2 J2.3 U9.5 U9.6
$1N3617: R5.2 R5.3 R7.1
$1N3639: R8.2 R8.3 R10.1
$1N4317: D2.2 U7.2
$1N4424: D7.2 U10.2
$1N4465: D5.2 D6.2 U8.2
$1N5157: R3.2 U3.4
$1N5164: LED1.2 LED2.1 LED3.2 LED4.1 R3.1
$1N5205: LED3.1 LED4.2 U3.3
$1N5221: LED1.1 LED2.2 U3.2
$1N5255: R4.1 U3.5
$1N6778: U2.1 U3.7
$1N6905: R4.2 SW1.1 SW1.2
$1N7101: C7.2 U3.6 U4.1
$1N13509: R2.2 U1.2
$1N13530: U1.3 U5.5
$1N13537: U1.1 U5.4
$1N13688: C6.2 NOREF#11.1 NOREF#53.1 R1.1 U1.5
$1N13830: NOREF#44.1 R8.1 U9.1
$1N13861: NOREF#32.1 R5.1 U6.1
$1N21573: J1.A5 R12.2
$1N21578: J1.B5 R13.2

Pads without a net: J1 2 4; SCREW1 1; SCREW2 1; SCREW3 1; SCREW4 1; SCREW5 1; SCREW6 1; U1 4; U5 1 8; U6 7; U9 7

## Routing (per net, layer and track width the routed paths; a pad name or vN(x,y) marks a point on that pad's centre or on a via; arc(x,y) is an arc through that point)
GND: length 4.6
  Bottom Layer w0.254: U6.2 64.9,15.24 64.76,15.37 ; U9.2 54.36,15.24 54.22,15.37
BAT-: length 14.4
  Bottom Layer w0.254: U5.3 59.64,25.52 58.93,25.52 58.22,26.23 ; 58.22,26.23 58.22,27.5 57.78,27.94 53.91,27.94 ; 58.22,26.23 U5.2 ; 53.91,27.94 53.97,28 C6.1 ; 53.91,27.94 52.71,27.94 51.94,27.17 U1.6
CE_A: length 53.8
  Top Layer w1: NOREF#2.1 23.24,8.25 27.05,12.06 42.29,12.06 52.71,22.47 57.28,22.47 59.18,20.57 65.28,20.57 NOREF#48.1
  Bottom Layer w0.254: NOREF#48.1 67.21,18.64 U6.8
CE_B: length 19.2
  Top Layer w1: NOREF#12.1 53.47,20.57 45.72,12.82 45.72,9.01 NOREF#40.1
  Bottom Layer w0.254: NOREF#12.1 U9.8
LEDA: length 2.9
  Bottom Layer w0.254: 37.47,20.04 36.42,18.99 J2.1
$1N3617: length 4.2
  Bottom Layer w1: R7.1 65.63,9 R5.3 R5.2
$1N3639: length 4.2
  Bottom Layer w1: 65.78,3 R8.3 R8.2
$1N4317: length 5.3
  Bottom Layer w1: U7.2 18.03,4.27 18.03,6.95 D2.2
$1N4424: length 7.7
  Bottom Layer w1: U10.2 48.84,2.99 49.15,3.3 49.15,6.52 D7.2
$1N4465: length 18.1
  Bottom Layer w1: D6.2 34.09,7.67 33.91,7.49 ; U8.2 33.91,5.15 33.91,7.49 ; 33.91,7.49 33.82,7.57 27.85,7.57 D5.2
$1N5157: length 9.9
  Bottom Layer w0.254: U3.4 28.18,11.48 R3.2
$1N5164: length 9.8
  Bottom Layer w0.254: LED1.2 32.82,19.03 LED2.1 32.8,16.54 LED3.2 LED4.1 33.23,11.38 R3.1
$1N5205: length 9.4
  Bottom Layer w0.254: U3.3 28.7,19.68 29.46,18.92 29.46,15.11 30.44,14.13 LED3.1 LED4.2
$1N5221: length 5.8
  Bottom Layer w0.254: LED2.2 30.72,19.03 LED1.1 28.79,20.95 U3.2
$1N5255: length 15.6
  Bottom Layer w0.254: R4.1 13.16,9.39 13.72,9.39 15.75,11.43 15.75,14.98 17.02,16.25 20.21,16.25 U3.5
$1N6905: length 8.2
  Bottom Layer w0.254: R4.2 9.82,10.49 SW1.1 7.5,12.7 3.42,12.7 SW1.2
$1N7101: length 14.9
  Bottom Layer w0.254: U3.6 21.84,19.68 21.08,18.92 21.08,18.16 20.45,17.52 16.76,17.52 14.28,15.04 C7.2
  Bottom Layer w1: U4.1 13.89,14.1 C7.2
$1N13509: length 4.9
  Bottom Layer w0.254: U1.2 49.54,24 49.28,23.75 47.29,23.75 R2.2
$1N13530: length 6.7
  Bottom Layer w0.254: U1.3 48.59,25.72 48.9,26.03 51.56,26.03 52.66,24.93 U5.5
$1N13537: length 10.3
  Bottom Layer w0.254: U1.1 51.76,24.88 52.63,24 59.31,24 59.7,24.39 U5.4
$1N13688: length 17.9
  Top Layer w1: NOREF#11.1 47.75,28.7 46.23,27.17 NOREF#53.1
  Bottom Layer w0.254: C6.2 49.97,28.7 NOREF#11.1 49.54,28.06 U1.5 ; R1.1 46.86,18.54 46.35,19.05
$1N13830: length 11.5
  Top Layer w1: R8.1 59.07,4.81 55.63,8.25 NOREF#44.1
  Bottom Layer w0.254: NOREF#44.1 U9.1
$1N13861: length 9.8
  Top Layer w1: R5.1 61.38,11.3 NOREF#32.1
  Bottom Layer w0.254: NOREF#32.1 U6.1

## Copper pours and planes (outline as drawn; the poured copper is in the pictures)
GND on Top Layer: 0,32 76,32 76,0 0,0
GND on Bottom Layer: 3.17,22.47 0.89,20.19 0,20.19 0,25.09 3,25.09 3.17,25.08
GND on Bottom Layer: 0,32 76,32 76,0 0,0
GND on Bottom Layer: 53.09,26.41 53.09,25.4 53.21,25.27 54.8,25.27 54.8,24.4 58.66,24.4 58.66,25.77 57.02,27.41 54.8,27.41 54.8,26.55 53.22,26.55
VBUS on Top Layer: 58.35,32 58.35,29.14 57.4,28.19 50.8,28.19 49.15,29.84 37.08,29.84 30.73,23.49 27.71,23.49 27.71,31.98 27.69,32
VBUS on Bottom Layer: 27.32,21.84 29.34,21.84 30.48,22.98 30.48,27.43 29.59,28.32 26,28.32 26,23.16
VBUS on Bottom Layer: 68.07,26.92 62.36,26.92 60.83,28.44 56.64,28.44 55.88,29.21 55.88,31.06 56.82,32 67.06,32 68.07,30.98
VBUS on Bottom Layer: 70.49,24.89 70.49,24 67.06,24 64,27.06 68.03,27.06 68.03,26.07 69.22,24.89
VBUS on Bottom Layer: 67.56,27.92 70.44,27.92 70.44,27.12 67.56,27.12
BAT+ on Top Layer: 0,32.13 10.03,32.13 10.03,23.83 0,23.83
BAT+ on Bottom Layer: 56.64,15.11 61.35,15.11 62.1,14.35 63.75,14.35 64.13,13.97 64.13,11.55 63.12,10.54 58.17,10.54 56.77,9.14 56.77,4.82 57.4,4.19 57.4,2.41 56.51,1.52 50.93,1.52 49.91,2.54 49.91,5.33 51.69,7.11 51.69,11.43 49.91,13.2 48.77,13.2 48.39,13.58 46.48,13.58 45.97,14.09 45.97,15.49 50.05,15.49 51.19,14.35 53.47,14.35 53.47,11.68 54.86,10.28 56.01,10.28 56.64,10.92
BAT+ on Bottom Layer: 10.13,32 10.13,13.61 10.29,13.46 5.43,13.46 4.79,14.1 2.93,14.1 2.29,13.46 2.29,9.14 4.06,7.36 9.02,7.36 12.38,4 57.42,4 57.42,0 0,0 0,18.7 4.32,22.71 4.32,26.25 0,30.33 0,32
BAT- on Top Layer: 75.56,31.36 75.56,23.72 58.93,23.72 58.93,31.36
BAT- on Bottom Layer: 59.06,26.41 63.63,26.41 64.64,25.4 64.64,23.75 61.09,23.75 60.71,24.13 60.71,25.02 60.45,25.27 59.06,25.27
CE_A on Bottom Layer: 19.92,6.56 25.03,6.56 25.45,6.98 25.45,8 24.69,8.77 24.69,10.87 23.62,11.93 19.94,11.93 19.43,11.43 19.43,7.05
CE_B on Bottom Layer: 48.39,11.43 48.39,7.71 47.6,6.92 42.8,6.92 42.8,10.66 43.69,11.55 48.26,11.55
LEDA on Bottom Layer: 34.16,18.32 34.76,17.72 37.67,17.72 38.74,18.79 38.74,20.95 39.62,21.84 58.42,21.84 61.98,18.28 61.98,17.65 62.23,17.39 63.92,17.39 64.13,17.6 64.13,19.43 60.2,23.36 37.83,23.36 34.16,19.94
LEDB on Bottom Layer: 39.22,18.43 39.45,18.21 43.55,18.21 45.28,19.94 49.93,19.94 51.23,18.64 51.23,17.47 51.31,17.39 53.47,17.39 53.47,20.57 52.58,21.46 40.64,21.46 39.22,20.04
$1N6778 on Bottom Layer: 22.99,21.2 21.21,21.2 20.32,22.09 16.76,22.09 16.76,18.54 20.28,18.54 20.28,20.15 20.83,20.7 22.99,20.7
$1N11856 on Bottom Layer: 23.22,21.82 21.74,21.82 18.67,24.89 15.88,24.89 14.97,25.8 14.97,28.07 15.12,28.22 21.81,28.22 22.1,27.94 22.1,23.68 23.22,22.55

Small or netless copper shapes (teardrops, artwork), in the pictures only: 3 on Top Layer, 72 on Bottom Layer

## Text on the board
Bottom Silkscreen Layer: 25% / 50% / 75% / 100%
Top Silkscreen Layer: BAT+ | 3.6-4.2V / 18650 | Dual Laser Drver 2.2 / antoni.pajewski@o2.pl / 12.09.2024 | BAT-
